# Altium project NTC_Arm.PrjPcb
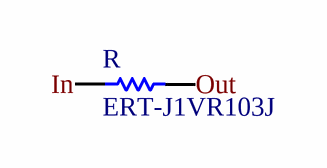
[diagram p0: NTC_Arm.SchDoc]
1 sheet, 1 parts. Net scope: global (net labels, ports and power ports of the same name join across sheets).
Board files: NTC_Arm.PcbDoc, NTC_Arm_2.PcbDoc

## Sheet NTC_Arm.SchDoc: Sheetname
size A4; Date: 05.10.2017; CheckedBy: UNCHECKED; Author: Team Member; Organization: Baltic Racing; Address1: Zur Schwedenschanze 15; Address2: Haus 18; Address3: 18435 Stralsund; Revision: xx.xx; SheetNumber: 1; SheetTotal: 1; Rules: TODO; ProjectName: Projekt

### Parts
R  ERT-J1VR103J  [RESC1608X90X30ML15T20]

### Nets
In: R.1
Out: R.2

### Notes on the sheet
- Title:
- Projekt:
- Revision:
- Author:
- Rules:
- Checked by:
- Sheet
- of
- Size:
- A4
- Date:
- Time:

### Library data of the parts
R = CMP-2000-00869-1: Manufacturer: Panasonic; Part Number: ERT-J1VR103J